# Altium schematic sheet VCXO_25M_PTP.SchDoc: SPEC-A7
size 420 x 297 mm; Author: G.Kasprowicz; CompanyName: WUT ISE; DrawnBy: G.Kasprowicz; Organization: WUT ISE; Address1: PW ISE; Address2: Nowowiejska 15/19 00-665 Warsaw; Address3: gkasprow@gmail.com; Revision: 2; SheetNumber: 8; SheetTotal: 18; ModifiedBy: -; CheckedDate: -; Title2: 25MHz VCXO; DivGrp: WUT ISE; Designer: G.Kasprowicz; ModifiedDate: -; ProjectName: Sensor Box
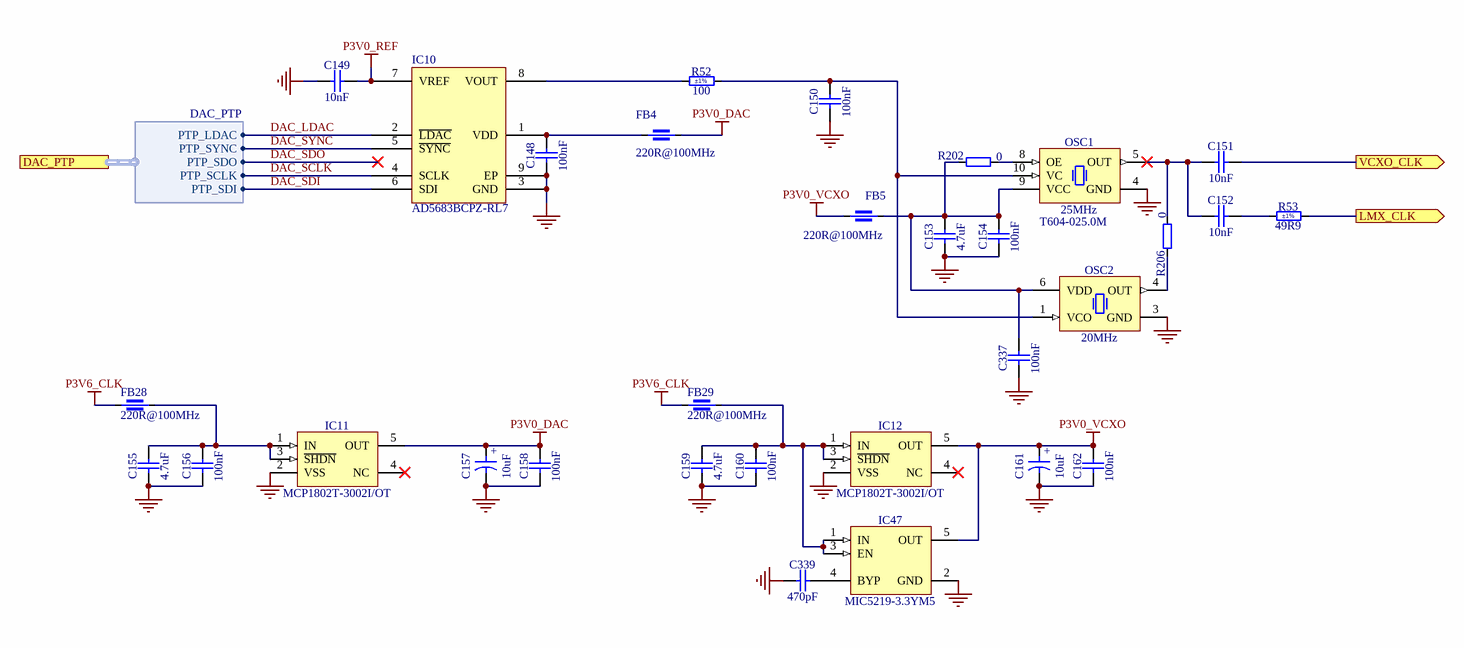
[diagram p0: VCXO_25M_PTP.SchDoc]

## Parts
C148  100nF  [CAPC0603X33N]
C149  10nF  [CAPC1005X55N]
C150  100nF  [CAPC2012X88N]
C151  10nF  [CAPC1005X55N]
C152  10nF  [CAPC1005X55N]
C153  4.7uF  [CAPC1005X55N]
C154  100nF  [CAPC0603X33N]
C155  4.7uF  [CAPC1005X55N]
C156  100nF  [CAPC0603X33N]
C157  10uF  [CAPMP3216X180N]
C158  100nF  [CAPC0603X33N]
C159  4.7uF  [CAPC1005X55N]
C160  100nF  [CAPC0603X33N]
C161  10uF  [CAPMP3216X180N]
C162  100nF  [CAPC0603X33N]
C337  100nF  [CAPC0603X33N]
C339  470pF  [CAPC1005X55N]
FB4  220R@100MHz  [INDC1608X95N]
FB5  220R@100MHz  [INDC1608X95N]
FB28  220R@100MHz  [INDC1608X95N]
FB29  220R@100MHz  [INDC1608X95N]
IC10  AD5683BCPZ-RL7  [SON50P200X60_HS-9N]
IC11  MCP1802T-3002I/OT  [SOT95P270X145-5N]
IC12  MCP1802T-3002I/OT  [SOT95P270X145-5N]
IC47  MIC5219-3.3YM5  [SOT95P280X145-5N]
OSC1  25MHz  Manufacturer Part Number: T604-025.0M  [OSC_CONNOR-WINFIELD_T]
OSC2  20MHz  [OSC_CONNOR-WINFIELD_DOT050V]
R52  100  Tolerance: ±1%  [RESC1005X40N]
R53  49R9  Tolerance: ±1%  [RESC1005X40N]
R202  0  [RESC1005X40N]
R206  0  [RESC1005X40N]

## Ports
DAC_PTP (harness DAC_PTP, see SPEC-A7-TOP[2C], FPGA_14_15[1E]), LMX_CLK (out, see SPEC-A7-TOP[2C], Clocks_PLL[1C]), VCXO_CLK (out, see SPEC-A7-TOP[2C])

## Harnesses
DAC_PTP: PTP_LDAC, PTP_SYNC, PTP_SCLK, PTP_SDI, PTP_SDO

## Nets
GND: C148.1 C149.1 C150.1 C153.1 C154.1 C155.1 C156.1 C157.2 C158.1 C159.1 C160.1 C161.2 C162.1 C337.1 C339.1 IC10.3(GND) IC10.9(EP) IC11.2(VSS) IC12.2(VSS) IC47.2(GND) OSC1.4(GND) OSC2.3(GND)
P3V0_DAC: C157.1 C158.2 FB4.1 IC11.5(OUT)
P3V0_REF: C149.2 IC10.7(VREF)
P3V0_VCXO: C161.1 C162.2 FB5.1 IC12.5(OUT) IC47.5(OUT)
P3V6_CLK: FB28.2 FB29.2
DAC_LDAC: IC10.2(~{LDAC}) ; port DAC_PTP.PTP_LDAC
DAC_SCLK: IC10.4(SCLK) ; port DAC_PTP.PTP_SCLK
DAC_SDI: IC10.6(SDI) ; port DAC_PTP.PTP_SDI
DAC_SDO: port DAC_PTP.PTP_SDO
DAC_SYNC: IC10.5(~{SYNC}) ; port DAC_PTP.PTP_SYNC
LMX_CLK: R53.2 ; port LMX_CLK
VCXO_CLK: C151.2 ; port VCXO_CLK
NetC148_2: C148.2 FB4.2 IC10.1(VDD)
NetC150_2: C150.2 OSC1.10(VC) OSC2.1(VCO) R52.2
NetC151_1: C151.1 C152.1 OSC1.5(OUT) R206.2
NetC152_2: C152.2 R53.1
NetC153_2: C153.2 C154.2 C337.2 FB5.2 OSC1.9(VCC) OSC2.6(VDD) R202.1
NetC155_2: C155.2 C156.2 FB28.1 IC11.1(IN) IC11.3(~{SHDN})
NetC159_2: C159.2 C160.2 FB29.1 IC12.1(IN) IC12.3(~{SHDN}) IC47.1(IN) IC47.3(EN)
NetC339_2: C339.2 IC47.4(BYP)
NetIC10_8: IC10.8(VOUT) R52.1
NetOSC1_8: OSC1.8(OE) R202.2
NetOSC2_4: OSC2.4(OUT) R206.1

Not connected (* = marked no-connect by the designer): IC11 4(NC)*; IC12 4(NC)*

## Notes on the sheet
- Project/Equipment
- Document
- Designer
- Drawn by
- Check.by
- Copyright WUT ISE 2024.
  This documentation describes Open Hardware and is licensed under the CERN OHL v.2. You may redistribute and modify this documentation under the terms of the CERN OHL v.2. (http://ohwr.org/CERNOHL). This documentation is distributed WITHOUT ANY EXPRESS OR IMPLIED WARRANTY, INCLUDING OF MERCHANTABILITY, SATISFACTORY QUALITY AND FITNESS FOR A PARTICULAR PURPOSE. Please see the CERN OHL v.2 for applicable conditions.
- Contact
- File
- Last Mod.
- Print Date
- Sheet
- Size
- A3
- of
- Rev
- (in symbol CTE3216-18_10UF_10V_10%_LESR1800) +

## Library data of the parts
C148 C154 C156 C158 C160 C162 C337 = CC0201_100NF_6.3V_10%_X5R: Non-polarised capacitor; Part Description: SMD Multilayer Chip Ceramic Capacitor; Manufacturer: GENERIC; Manufacturer1 Part Number: 02016D104KAT2A; Voltage: 6.3V; TC: X5R; Tolerance: ±10%; Part Number: CC0201_100NF_6.3V_10%_X5R; Component Kind: Standard; Component Type: Standard; Pin Count: 2; Value: 100nF; Status: Not Recommended; Manufacturer Part Number: CC0201_100NF_6.3V_10%_X5R; Case: 0201; Mounted: Yes; Socket: No; SMD: Yes; Sense: No; Manufacturer1 Example: AVX; Manufacturer1 ComponentHeight: 0.33mm; HelpURL: \\cern.ch\dfs\Applications\Altium\Datasheets\CC0201_X5R_AVX.pdf; Author: CERN DEM JLC; CreateDate: 03.12.2007; LatestRevisionDate: 03.12.2007
C149 C151 C152 = CC0402_10NF_16V_10%_X7R: Non-polarised capacitor; Part Description: SMD Multilayer Chip Ceramic Capacitor; Manufacturer: GENERIC; Manufacturer1 Part Number: 223878715636; Voltage: 16V; TC: X7R; Tolerance: ±10%; Part Number: CC0402_10NF_16V_10%_X7R; Component Kind: Standard; Component Type: Standard; Pin Count: 2; Value: 10nF; Status: Not Recommended; Manufacturer Part Number: CC0402_10NF_16V_10%_X7R; Case: 0402; Mounted: Yes; Socket: No; SMD: Yes; Sense: No; Manufacturer1 Example: PHYCOMP; Manufacturer1 ComponentHeight: 0.55mm; HelpURL: \\cern.ch\dfs\Applications\Altium\Datasheets\CC0402_X7R_PHYCOMP.pdf; Author: CERN DEM JLC; CreateDate: 03.12.2007; LatestRevisionDate: 03.12.2007
C150 = CC0805_100NF_50V_1%_NP0: Non-polarised capacitor; Part Description: SMD Multilayer Chip Ceramic Capacitor; Manufacturer: GENERIC; Manufacturer1 Part Number: 0805N103F500C; Voltage: 50V; TC: C0G/NP0; Tolerance: ±1%; Part Number: CC0805_100NF_50V_1%_NP0; Component Kind: Standard; Component Type: Standard; Footprint: CAPC2012X135N; Pin Count: 2; Value: 100nF; Status: Not Recommended; Manufacturer Part Number: CC0805_100NF_50V_1%_NP0; Case: 0805; Mounted: Yes; Socket: No; SMD: Yes; Sense: No; Manufacturer1 Example: WALSIN TECHNOLOGY CORPORATION; Manufacturer1 ComponentHeight: 1.35mm; HelpURL: \\cern.ch\dfs\Applications\Altium\Datasheets\CC0805_WALSIN_0805.pdf; Author: CERN DEM HF; CreateDate: 28.08.2023; LatestRevisionDate: 28.08.2023; ComponentHeight: 1.35mm
C153 C155 C159 = CC0402_4.7UF_6.3V_20%_X5R: Non-polarised capacitor; Part Description: SMD Multilayer Chip Ceramic Capacitor; Manufacturer: GENERIC; Manufacturer1 Part Number: C1005X5R0J475M050BC; Voltage: 6.3V; TC: X5R; Tolerance: ±20%; Part Number: CC0402_4.7UF_6.3V_20%_X5R; Component Kind: Standard; Component Type: Standard; Pin Count: 2; Value: 4.7uF; Status: Preferred; Manufacturer Part Number: CC0402_4.7UF_6.3V_20%_X5R; Case: 0402; Mounted: Yes; Socket: No; SMD: Yes; Sense: No; Manufacturer1 Example: TDK; Manufacturer1 ComponentHeight: 0.65mm; HelpURL: \\cern.ch\dfs\Applications\Altium\Datasheets\CC0402_X5R_TDK_C.pdf; Author: CERN DEM JLC; CreateDate: 03.03.2015; LatestRevisionDate: 03.03.2015
C157 C161 = CTE3216-18_10UF_10V_10%_LESR1800: Polarised capacitor; Part Description: Low ESR 1R8 Solid Tantalum Chip Capacitor; Manufacturer: GENERIC; Manufacturer1 Part Number: TPSA106K010R1800; Voltage: 10V; Tolerance: ±10%; Part Number: CTE3216-18_10UF_10V_10%_LESR1800; Component Kind: Standard; Component Type: Standard; Pin Count: 2; Value: 10uF; Status: Preferred; Manufacturer Part Number: CTE3216-18_10UF_10V_10%_LESR1800; Case: A; Mounted: Yes; Socket: No; SMD: Yes; Sense: No; Manufacturer1 Example: AVX; Manufacturer1 ComponentHeight: 1.8mm; HelpURL: \\cern.ch\dfs\Applications\Altium\Datasheets\CTE-LESR_AVX_TPS.pdf; Author: CERN DEM JLC; CreateDate: 05.05.2008; LatestRevisionDate: 20.01.2009
C339 = CC0402_470PF_50V_10%_X7R: Non-polarised capacitor; Part Description: SMD Multilayer Chip Ceramic Capacitor; Manufacturer: GENERIC; Manufacturer1 Part Number: 223858715618; Voltage: 50V; TC: X7R; Tolerance: ±10%; Part Number: CC0402_470PF_50V_10%_X7R; Component Kind: Standard; Component Type: Standard; Pin Count: 2; Value: 470pF; Status: Not Recommended; Manufacturer Part Number: CC0402_470PF_50V_10%_X7R; Case: 0402; Mounted: Yes; Socket: No; SMD: Yes; Sense: No; Manufacturer1 Example: PHYCOMP; Manufacturer1 ComponentHeight: 0.55mm; HelpURL: \\cern.ch\dfs\Applications\Altium\Datasheets\CC0402_NP0_PHYCOMP.pdf; Author: CERN DEM JLC; CreateDate: 03.12.2007; LatestRevisionDate: 03.12.2007
FB4 FB5 FB28 FB29 = IND0603_MURATA_BLM18SG221TN1: Part Description: SMD EMIFIL Suppression Chip Ferrite Bead; Manufacturer: MURATA; Tolerance: ±25%; Power: 2.5A; Resistance: 0.04R; Part Number: IND0603_MURATA_BLM18SG221TN1; Component Kind: Standard; Component Type: Standard; Pin Count: 2; Value: 220R@100MHz; Manufacturer Part Number: BLM18SG221TN1; Case: 0603; Mounted: Yes; Socket: No; SMD: Yes; Sense: No; ComponentHeight: 0.95mm; HelpURL: \\cern.ch\dfs\Applications\Altium\Datasheets\IND0603_MURATA_BLM18S.pdf; Author: CERN DEM MR; CreateDate: 08.01.2016; LatestRevisionDate: 25.10.2018
IC10 = CMP-016-00740-2: IC DAC 16BIT V-OUT 8LFCSP 16 Bit Digital to Analog Converter 1 8-LFCSP-UD (2x2); Manufacturer: Analog Devices; Max Supply Voltage: 5.5V; Min Supply Voltage: 2.7V; Mounting Technology: Surface Mount; Max Operating Temperature: 105°C; Min Operating Temperature: -40°C; Pins: 8; Manufacturer Part Number: AD5683BCPZ-RL7
IC11 IC12 = MCP1802T-3002I/OT: 300mA, High PSRR, Low Quiescent Current LDO; Part Description: 3V, 300mA, High PSRR, Low Quiescent Current LDO; Manufacturer: MICROCHIP TECHNOLOGY; PressFit: No; Bonding: No; Part Number: MCP1802T-3002I/OT; Component Kind: Standard; Component Type: Standard; Device: MCP1802T-3002I/OT; PackageDescription: SOT, 0.95mm Pitch; 5 Pin,1.55mm W X 2.90mm L X 1.45mm H body, IPC Medium Density; Manufacturer Part Number: MCP1802T-3002I/OT; Pin Count: 3; Case: SOT23-5; Mounted: Yes; Socket: No; SMD: Yes; Sense: No; ComponentHeight: 1.45mm; HelpURL: \\cern.ch\dfs\Applications\Altium\Datasheets\MCP1802T-3002I-OT.pdf; Author: CERN DEM JLC; CreateDate: 03.05.2012; LatestRevisionDate: 17.09.2014
IC47 = MIC5219-3.3YM5: 500mA Peak Output LDO Regulator; Part Description: 3.3V 500mA Peak Output Low Drop-Out  (LDO) Regulator; Manufacturer: MICROCHIP TECHNOLOGY; PressFit: No; Bonding: No; Part Number: MIC5219-3.3YM5; Component Kind: Standard; Component Type: Standard; Device: MIC5219-3.3YM5; PackageDescription: SOT, 0.95mm pitch; 5 pin, 1.60mm W X 2.90mm L X 1.45mm H body, IPC Medium Density; Manufacturer Part Number: MIC5219-3.3YM5; Pin Count: 5; Case: SOT23-5; Mounted: Yes; Socket: No; SMD: Yes; Sense: No; ComponentHeight: 1.45mm; HelpURL: \\cern.ch\dfs\Applications\Altium\Datasheets\MIC5219-3.3YM5.pdf; Author: CERN DEM WB; CreateDate: 2019-04-16; LatestRevisionDate: 2019-04-16
OSC1 = OSC_25MHZ_CONNOR-WINFIELD_T604-025.0M: Oscillator 4 pins 4=GND 5=OUT 8=OE 9=VCC 10=VC; Part Description: 3.3V, ±0.28ppm, 15pF, -40°C to 85°C, LVCMOS,  Precision Tri-State Surface Mount VCTCXO, T Series; PressFit: No; Bonding: No; Part Number: OSC_25MHZ_CONNOR-WINFIELD_T604-025.0M; Component Kind: Standard; Component Type: Standard; PackageDescription: SMD VCTCXO, Side Concave, 10 Pins, 5.00x7.00mm, T Series; Value: 25MHz; Manufacturer: CONNOR-WINFIELD; Pin Count: 10; Mounted: Yes; Socket: No; SMD: Yes; Sense: No; ComponentHeight: 2.4mm; HelpURL: \\cern.ch\dfs\Applications\Altium\Datasheets\OSC_CONNOR-WINFIELD_T.pdf; Author: CERN DEM MR; CreateDate: 12.09.2016; LatestRevisionDate: 22.04.2021
OSC2 = OSC_20MHZ_CONNOR-WINFIELD_DOT050V-020.0M: Oscillator 4 pins 1=VCO 3=GND 4=OUT 6=VCC; Part Description: 3.3V, ±0.05ppm, 15pF, 0 to 70°C, LVCMOS, Precision Surface Mount VCTCXO Temperature Compensated Crystal Oscillator, DOT050V Series; PressFit: No; Bonding: No; Part Number: OSC_20MHZ_CONNOR-WINFIELD_DOT050V-020.0M; Component Kind: Standard; Component Type: Standard; PackageDescription: SMD VCTCXO, Side Concave, 6 Pins, 9.00mm x 14.0mm, DOT050V Series; Value: 20MHz; Manufacturer: CONNOR-WINFIELD; Manufacturer Part Number: DOT050V-020.0M; Pin Count: 6; Mounted: Yes; Socket: No; SMD: Yes; Sense: No; ComponentHeight: 6.86mm; HelpURL: \\cern.ch\dfs\Applications\Altium\Datasheets\OSC_CONNOR-WINFIELD_DOT050V.pdf; Author: CERN DEM BC; CreateDate: 04.11.2016; LatestRevisionDate: 04.11.2016
R52 = R0402_100R_1%_0.0625W_100PPM: Resistor - 1%; Part Description: General Purpose Thick Film Chip Resistor; Manufacturer: GENERIC; Manufacturer1 Part Number: 232270671001L; TC: ±100ppm/°C; PressFit: No; Part Number: R0402_100R_1%_0.0625W_100PPM; Component Kind: Standard; Component Type: Standard; Pin Count: 2; Value: 100; Status: Not Recommended; Power: 0.0625W; Manufacturer Part Number: R0402_100R_1%_0.0625W_100PPM; Case: 0402; Mounted: Yes; Sense: No; Socket: No; SMD: Yes; Manufacturer1 Example: YAGEO PHYCOMP; Manufacturer1 ComponentHeight: 0.4mm; HelpURL: \\cern.ch\dfs\Applications\Altium\Datasheets\R0402_Phycomp_RC0402.pdf; Author: CERN DEM JLC; CreateDate: 03.12.2007; LatestRevisionDate: 17.10.2012
R53 = R0402_49R9_1%_0.0625W_100PPM: Resistor - 1%; Part Description: General Purpose Thick Film Chip Resistor; Manufacturer: GENERIC; Manufacturer1 Part Number: 232270674999L or RC0402FR-0749R9L; TC: ±100ppm/°C; PressFit: No; Part Number: R0402_49R9_1%_0.0625W_100PPM; Component Kind: Standard; Component Type: Standard; Pin Count: 2; Value: 49R9; Status: Not Recommended; Power: 0.0625W; Manufacturer Part Number: R0402_49R9_1%_0.0625W_100PPM; Case: 0402; Mounted: Yes; Sense: No; Socket: No; SMD: Yes; Manufacturer1 Example: YAGEO PHYCOMP; Manufacturer1 ComponentHeight: 0.4mm; HelpURL: \\cern.ch\dfs\Applications\Altium\Datasheets\R0402_Phycomp_RC0402.pdf; Author: CERN DEM JLC; CreateDate: 24.10.2012; LatestRevisionDate: 24.10.2012
R202 R206 = R0402_0R_JUMPER: Resistor; Part Description: 1A (0.05R Max DC Resistance) Zero Ohm Jumper; Manufacturer: GENERIC; Manufacturer1 Part Number: 232270591001L; PressFit: No; Part Number: R0402_0R_JUMPER; Component Kind: Standard; Component Type: Standard; Pin Count: 2; Value: 0; Status: Not Recommended; Manufacturer Part Number: R0402_0R_JUMPER; Case: 0402; Mounted: Yes; Sense: No; Socket: No; SMD: Yes; Manufacturer1 Example: YAGEO PHYCOMP; Manufacturer1 ComponentHeight: 0.4mm; HelpURL: \\cern.ch\dfs\Applications\Altium\Datasheets\R0402_Phycomp_RC0402.pdf; Author: CERN DEM JLC; CreateDate: 03.12.2007; LatestRevisionDate: 17.10.2012